# EAGLE design ESP32_2 (EAGLE 9.6.2)
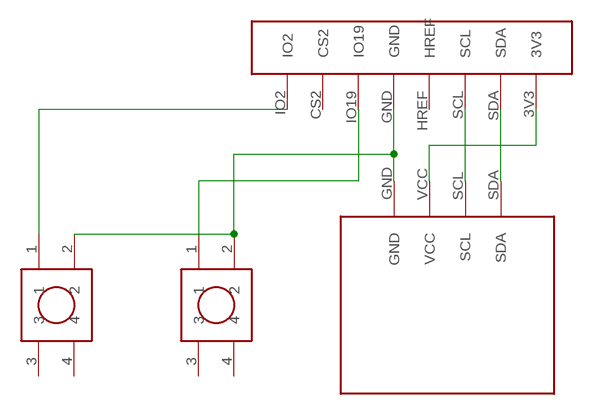
[diagram p0: schematic, sheet 1]

## Parts
U$1  TACT_BUTTON  [TACT_BUTTON]
U$2  TACT_BUTTON  [TACT_BUTTON]
U$3  OLED_0.96"  [OLED_0.96"]
U$4  ESP32_1X8  [ESP32_1X8]

## Nets
GND: U$1.2 U$2.2 U$3.GND U$4.GND
IO2: U$1.1 U$4.IO2
IO19: U$2.1 U$4.IO19
SCL: U$3.SCL U$4.SCL
SDA: U$3.SDA U$4.SDA
VCC: U$3.VCC U$4.3V3
Unconnected: U$1.3 U$1.4 U$2.3 U$2.4 U$4.CS2 U$4.HREF

## Library data of the parts
U$1 U$2 = ESP32_SNIFFER:TACT_BUTTON
U$3 = ESP32_SNIFFER:OLED_0.96"
U$4 = ESP32_SNIFFER:ESP32_1X8

## Board
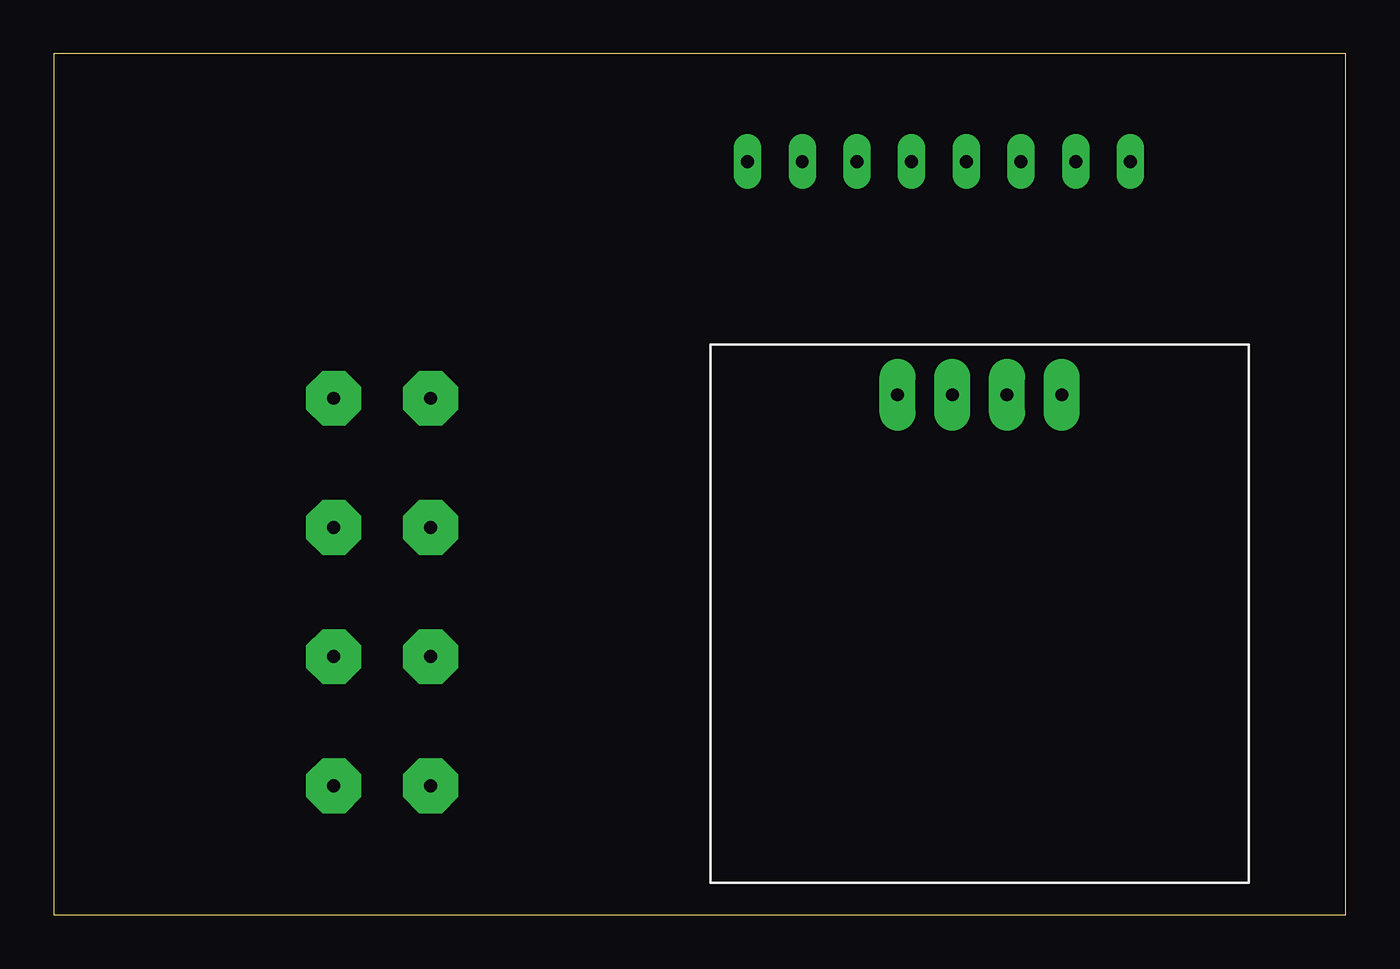
[diagram p1: board, top side]
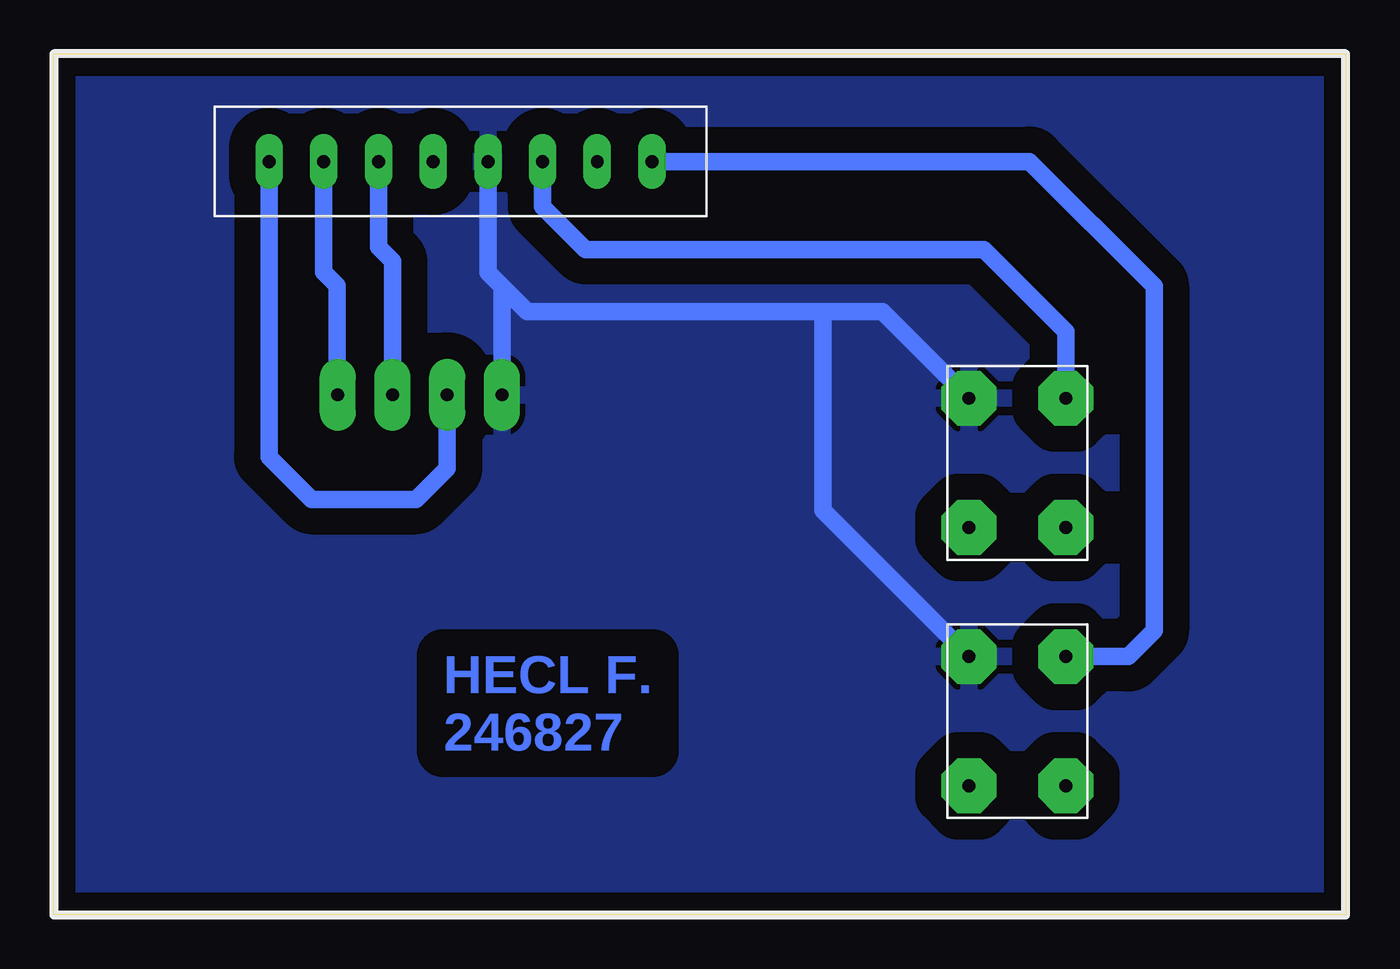
[diagram p2: board, bottom side, seen from below]

Size 60 x 40 mm. Coordinates in mm from the lower left corner, seen from the top.
Outline: 0,0 60,0 60,40 0,40 0,0
Copper layers (1*16): Top 0.035mm / dielectric 1.5mm / Bottom 0.035mm
Design rules "default *": minimum track width 32mil, minimum drill 0.8mm, track to track 48mil, track to pad 24mil, pad to pad 24mil, via to via 24mil, smd to smd 24mil, copper to edge 40mil, drill to drill 24mil, minimum pad ring 10mil, minimum via ring 8mil, stop-mask expansion 4mil, vias tented up to drill 0mil, thermal gap 10mil

### Footprints (pad centres in the part's own frame; a part is rotated, then mirrored left to right if it is on the bottom)
TACT_BUTTON = drill 0.6 pad 2.54 octagon: 1 0,6; 2 4.5,6; 3 0,0; 4 4.5,0
OLED_0.96" = drill 0.6 pad 1.676 long: GND -3.81,10.16; SCL 1.27,10.16; SDA 3.81,10.16; VCC -1.27,10.16
ESP32_1X8 = drill 0.6 pad 1.27 long: 3V3 0,0; CS2 -15.24,0; GND -10.16,0; HREF -7.62,0; IO2 -17.78,0; IO19 -12.7,0; SCL -5.08,0; SDA -2.54,0

### Placement (x,y rotation side)
U$1  13,6 0 top
U$2  13,18 0 top
U$3  43,14 0 top
U$4  50,35 0 top

### Tracks (layer width: path | path; a pad name or v marks a point on that pad's centre or on a via)
GND
  Bottom 0.813: 39.19,29.2 38.01,28.02 24.28,28.02 | 39.19,29.2 39.84,29.85 U$4.GND | 24.28,28.02 21.52,28.02 U$2.2 | U$1.2 24.28,18.78 24.28,28.02 | U$3.GND 39.19,29.2
  pour Bottom: 0,40 60,40 60,0 0,0
IO2
  Bottom 0.813: U$1.1 10.1,12 8.89,13.21 8.89,29.21 14.68,35 U$4.IO2
IO19
  Bottom 0.813: 37.24,34.94 U$4.IO19 37.3,32.91 35.3,30.91 16.81,30.91 13,27.1 U$2.1
SCL
  Bottom 0.813: U$3.SCL 44.27,30.36 44.92,31.01 U$4.SCL
SDA
  Bottom 0.813: U$4.SDA 47.46,29.86 46.84,29.24 46.84,24.19 U$3.SDA
VCC
  Bottom 0.813: 49.97,34.97 U$4.3V3 50,21.27 48.02,19.3 43.18,19.3 41.73,20.75 U$3.VCC

### Text on the board
Bottom: HECL F. / 246827